# EAGLE schematic photo transitor (EAGLE 9.5.2)
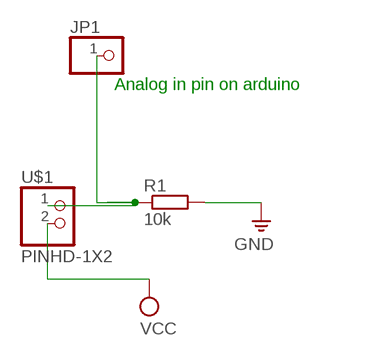
[diagram p0: schematic, sheet 1]

## Parts
JP1  PINHD-1X1  [1X01]
R1  10k  RESISTOR1206  [R1206]
U$1  PINHD-1X2  [1X02]

## Nets
GND: R1.2
N$2: JP1.1 R1.1 U$1.1
VCC: U$1.2

## Notes on the sheet
- Analog in pin on arduino

## Library data of the parts
JP1 = adafruit:PINHD-1X1: Pin header 1x1 for 0.1" spacing With round pins
R1 = code next:RESISTOR
U$1 = codenext2020:PINHD-1X2